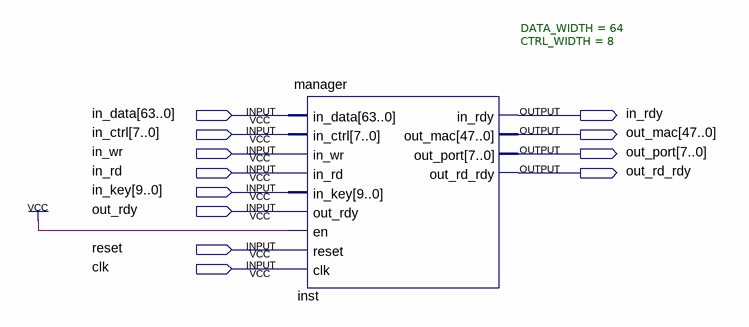
[diagram p0: schematic sheet]
// Quartus schematic LB.bdf as structural Verilog: 1 symbols, 12 pins
module LB (
  input  [63:0] in_data,
  input  [7:0] in_ctrl,
  input  in_wr,
  input  in_rd,
  input  [9:0] in_key,
  input  out_rdy,
  input  reset,
  input  clk,
  output in_rdy,
  output [47:0] out_mac,
  output [7:0] out_port,
  output out_rd_rdy
);

  manager #(.DATA_WIDTH(64), .CTRL_WIDTH(8)) inst (
    .in_data(in_data), .in_ctrl(in_ctrl), .in_wr(in_wr), .in_rd(in_rd), .in_key(in_key), .out_rdy(out_rdy),
    .en(1'b1), .reset(reset), .clk(clk), .in_rdy(in_rdy), .out_mac(out_mac), .out_port(out_port),
    .out_rd_rdy(out_rd_rdy));
endmodule
